# Altium schematic sheet Decoup_Cap 1.SchDoc
size A
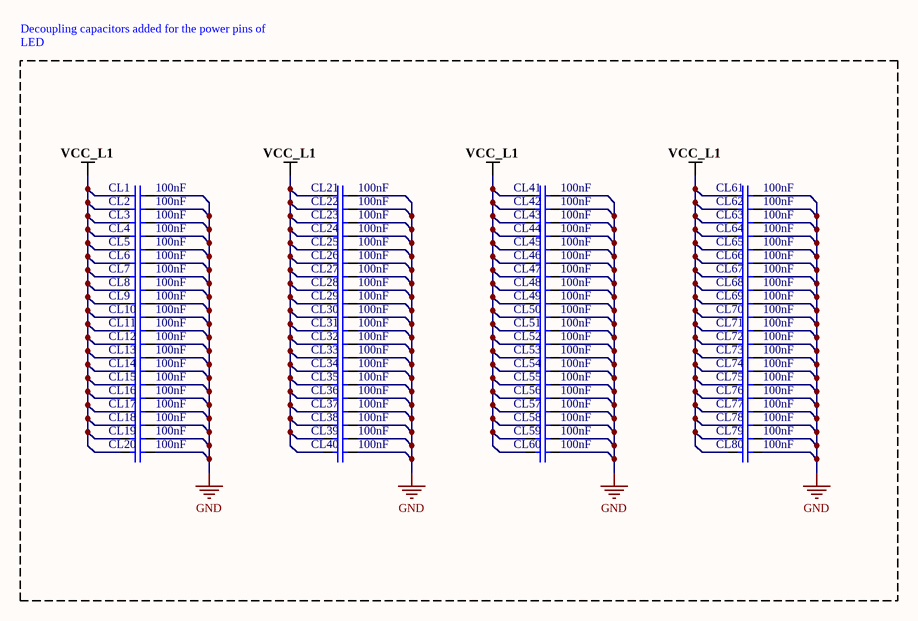
[diagram p0: Decoup_Cap 1.SchDoc]

## Parts
CL1  100nF  [Cap0402]
CL2  100nF  [Cap0402]
CL3  100nF  [Cap0402]
CL4  100nF  [Cap0402]
CL5  100nF  [Cap0402]
CL6  100nF  [Cap0402]
CL7  100nF  [Cap0402]
CL8  100nF  [Cap0402]
CL9  100nF  [Cap0402]
CL10  100nF  [Cap0402]
CL11  100nF  [Cap0402]
CL12  100nF  [Cap0402]
CL13  100nF  [Cap0402]
CL14  100nF  [Cap0402]
CL15  100nF  [Cap0402]
CL16  100nF  [Cap0402]
CL17  100nF  [Cap0402]
CL18  100nF  [Cap0402]
CL19  100nF  [Cap0402]
CL20  100nF  [Cap0402]
CL21  100nF  [Cap0402]
CL22  100nF  [Cap0402]
CL23  100nF  [Cap0402]
CL24  100nF  [Cap0402]
CL25  100nF  [Cap0402]
CL26  100nF  [Cap0402]
CL27  100nF  [Cap0402]
CL28  100nF  [Cap0402]
CL29  100nF  [Cap0402]
CL30  100nF  [Cap0402]
CL31  100nF  [Cap0402]
CL32  100nF  [Cap0402]
CL33  100nF  [Cap0402]
CL34  100nF  [Cap0402]
CL35  100nF  [Cap0402]
CL36  100nF  [Cap0402]
CL37  100nF  [Cap0402]
CL38  100nF  [Cap0402]
CL39  100nF  [Cap0402]
CL40  100nF  [Cap0402]
CL41  100nF  [Cap0402]
CL42  100nF  [Cap0402]
CL43  100nF  [Cap0402]
CL44  100nF  [Cap0402]
CL45  100nF  [Cap0402]
CL46  100nF  [Cap0402]
CL47  100nF  [Cap0402]
CL48  100nF  [Cap0402]
CL49  100nF  [Cap0402]
CL50  100nF  [Cap0402]
CL51  100nF  [Cap0402]
CL52  100nF  [Cap0402]
CL53  100nF  [Cap0402]
CL54  100nF  [Cap0402]
CL55  100nF  [Cap0402]
CL56  100nF  [Cap0402]
CL57  100nF  [Cap0402]
CL58  100nF  [Cap0402]
CL59  100nF  [Cap0402]
CL60  100nF  [Cap0402]
CL61  100nF  [Cap0402]
CL62  100nF  [Cap0402]
CL63  100nF  [Cap0402]
CL64  100nF  [Cap0402]
CL65  100nF  [Cap0402]
CL66  100nF  [Cap0402]
CL67  100nF  [Cap0402]
CL68  100nF  [Cap0402]
CL69  100nF  [Cap0402]
CL70  100nF  [Cap0402]
CL71  100nF  [Cap0402]
CL72  100nF  [Cap0402]
CL73  100nF  [Cap0402]
CL74  100nF  [Cap0402]
CL75  100nF  [Cap0402]
CL76  100nF  [Cap0402]
CL77  100nF  [Cap0402]
CL78  100nF  [Cap0402]
CL79  100nF  [Cap0402]
CL80  100nF  [Cap0402]

## Nets
GND: CL1.1 CL2.1 CL3.1 CL4.1 CL5.1 CL6.1 CL7.1 CL8.1 CL9.1 CL10.1 CL11.1 CL12.1 CL13.1 CL14.1 CL15.1 CL16.1 CL17.1 CL18.1 CL19.1 CL20.1 CL21.1 CL22.1 CL23.1 CL24.1 CL25.1 CL26.1 CL27.1 CL28.1 CL29.1 CL30.1 CL31.1 CL32.1 CL33.1 CL34.1 CL35.1 CL36.1 CL37.1 CL38.1 CL39.1 CL40.1 CL41.1 CL42.1 CL43.1 CL44.1 CL45.1 CL46.1 CL47.1 CL48.1 CL49.1 CL50.1 CL51.1 CL52.1 CL53.1 CL54.1 CL55.1 CL56.1 CL57.1 CL58.1 CL59.1 CL60.1 CL61.1 CL62.1 CL63.1 CL64.1 CL65.1 CL66.1 CL67.1 CL68.1 CL69.1 CL70.1 CL71.1 CL72.1 CL73.1 CL74.1 CL75.1 CL76.1 CL77.1 CL78.1 CL79.1 CL80.1
VCC_L1: CL1.2 CL2.2 CL3.2 CL4.2 CL5.2 CL6.2 CL7.2 CL8.2 CL9.2 CL10.2 CL11.2 CL12.2 CL13.2 CL14.2 CL15.2 CL16.2 CL17.2 CL18.2 CL19.2 CL20.2 CL21.2 CL22.2 CL23.2 CL24.2 CL25.2 CL26.2 CL27.2 CL28.2 CL29.2 CL30.2 CL31.2 CL32.2 CL33.2 CL34.2 CL35.2 CL36.2 CL37.2 CL38.2 CL39.2 CL40.2 CL41.2 CL42.2 CL43.2 CL44.2 CL45.2 CL46.2 CL47.2 CL48.2 CL49.2 CL50.2 CL51.2 CL52.2 CL53.2 CL54.2 CL55.2 CL56.2 CL57.2 CL58.2 CL59.2 CL60.2 CL61.2 CL62.2 CL63.2 CL64.2 CL65.2 CL66.2 CL67.2 CL68.2 CL69.2 CL70.2 CL71.2 CL72.2 CL73.2 CL74.2 CL75.2 CL76.2 CL77.2 CL78.2 CL79.2 CL80.2

## Notes on the sheet
- Decoupling capacitors added for the power pins of LED

## Library data of the parts
CL1-CL80 = CC0402KRX7R8BB104: Cap Ceramic 0.1uF 25V X7R 10% SMD 0402 125C Paper T/R; Manufacturer: Yageo; Dissipation Factor: 3.5%; Supplier 1: Digi-Key; Manufacturer Part Number: CC0402KRX7R8BB104; RoHS: Yes; Category: Ceramic Capacitors; Stock 1: 1841009; Pricing 1: 1=0.10000, 10=0.03100, 50=0.01700, 100=0.01390, 500=0.00990, 1000=0.00777, 2500=0.00707, 5000=0.00650 (USD); Mount: Surface Mount; Case/Package: 0402; Case Code (Imperial): 0402; Case Code (Metric): 1005; Min Operating Temperature: -55°C; Max Operating Temperature: 125°C; Tolerance: 10%; Capacitance: 100nF; Dielectric: X7R; Voltage Rating: 25V; Voltage Rating (DC): 25V; Packaging: Tape and Reel; Termination: SMD/SMT; Resistor Type: Ceramic; Length: 1mm; Width: 0.02inch; Height: 0.5mm; Thickness: 0.022inch; Depth: 0.5mm; Radiation Hardening: No; Lead Free: Lead Free; Halogen Free: Halogen Free; ComponentLink1URL: https://datasheet.ciiva.com/11464/upy-gphc-x7r-6-3v-to-50v-8-11464889.pdf?src-supplier=Avnet; ComponentLink1Description: https://datasheet.ciiva.com/11464/upy-gphc-x7r-6-3v-to-50v-8-11464889.pdf?src-supplier=Avnet; ComponentLink2URL: https://datasheet.ciiva.com/13210/upy-gphc-x7r-6-3v-to-50v-8-12304-13210908.pdf?src-supplier=Mouser; ComponentLink2Description: https://datasheet.ciiva.com/13210/upy-gphc-x7r-6-3v-to-50v-8-12304-13210908.pdf?src-supplier=Mouser; ComponentLink3URL: https://datasheet.ciiva.com/17437/upy-gphc-x7r-6-3v-to-50v-8-17437357.pdf?src-supplier=Avnet+Europe; ComponentLink3Description: https://datasheet.ciiva.com/17437/upy-gphc-x7r-6-3v-to-50v-8-17437357.pdf?src-supplier=Avnet+Europe; Supplier Part Number 1: 311-2077-1-ND